# Altium project Servo-Board-v1.0.PrjPcb (part 6 of 19)

## Sheet Encoder_Sheet1.SchDoc
size 420 x 297 mm; SheetNumber: 13; SheetTotal: 32
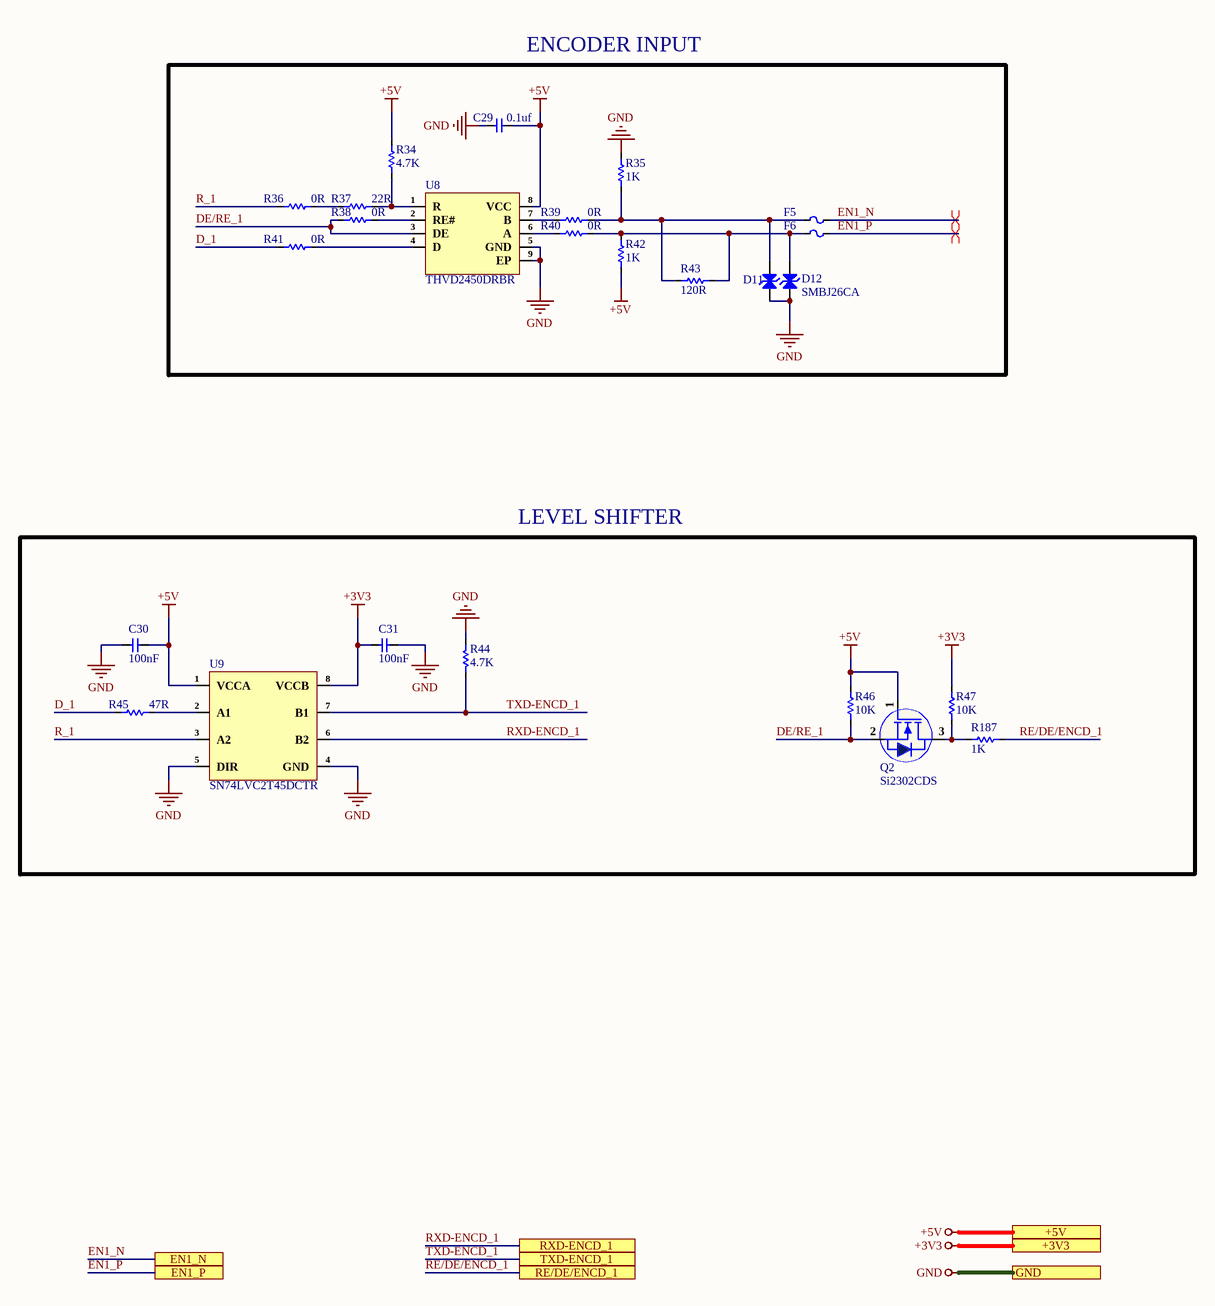
[diagram p12: Encoder_Sheet1.SchDoc]

### Parts
C29  0.1uf  [Cap-0402]
C30  100nF  [cap-0402]
C31  100nF  [cap-0402]
D11  SMBJ26CA  [SMB Bi Directional]  (value not drawn)
D12  SMBJ26CA  [SMB Bi Directional]
F5  SMD0805P020TF  [Fuse-0805]  (value not drawn)
F6  SMD0805P020TF  [Fuse-0805]  (value not drawn)
Q2  Si2302CDS  [Sot-23]
R34  4.7K  [Res-0402]
R35  1K  [Res-0402]
R36  0R  [Res-0603]
R37  22R  [Res-0402]
R38  0R  [Res-0603]
R39  0R  [Res-0603]
R40  0R  [Res-0603]
R41  0R  [Res-0603]
R42  1K  [Res-0402]
R43  120R  [Res-0402]
R44  4.7K  [Res-0402]
R45  47R  [Res-0402]
R46  10K  [Res-0402]
R47  10K  [Res-0402]
R187  1K  [Res-0603]
U8  THVD2450DRBR  [SON-8-EP(3x3)]
U9  SN74LVC2T45DCTR  [MSOP-8]

### Ports
+3V3 (see Servo1[3C], CAN_Sheet[5D], Connector_Sheet[5D], Controller_Sheet[5D], Encoder_Sheet2[5D], Encoder_Sheet3[5D], Encoder_Sheet4[5D], EtherCAT_Sheet[5D], Motor_Driver_Sheet1[5D], Motor_Driver_Sheet2[5D], Motor_Driver_Sheet3[5D], Motor_Driver_Sheet4[5D], Power_Sheet[5D], RJ45_Sheet[5D], RS485_RS232_Sheet[3D], Sec_Controller_Sheet1[5D], Sec_Controller_Sheet2[5D], Sec_Controller_Sheet3[5D], Sec_Controller_Sheet4[5D]), +5V (see Servo1[3C], CAN_Sheet[5D], DIO_1[5D], DIO_2[5D], DIO_3[5D], DIO_4[5D], Encoder_Sheet2[5D], Encoder_Sheet3[5D], Encoder_Sheet4[5D], Power_Sheet[5D]), EN1_N (see Servo1[3D], Connector_Sheet[3D], Servo1[3D]), EN1_P (see Servo1[3C], Connector_Sheet[3D], Servo1[3C]), GND (see Servo1[3C], CAN_Sheet[5D], Connector_Sheet[5D], Controller_Sheet[5D], DIO_1[5D], DIO_2[5D], DIO_3[5D], DIO_4[5D], Encoder_Sheet2[5D], Encoder_Sheet3[5D], Encoder_Sheet4[5D], EtherCAT_Sheet[5D], MOSFET_Driver_Sheet1[5D], MOSFET_Driver_Sheet2[5D], MOSFET_Driver_Sheet3[5D], MOSFET_Driver_Sheet4[5D], Motor_Driver_Sheet1[5D], Motor_Driver_Sheet2[5D], Motor_Driver_Sheet3[5D], Motor_Driver_Sheet4[5D], Power_Sheet[5D], RJ45_Sheet[5D], RS485_RS232_Sheet[3D], Sec_Controller_Sheet1[5D], Sec_Controller_Sheet2[5D], Sec_Controller_Sheet3[5D], Sec_Controller_Sheet4[5D]), RE/DE/ENCD_1 (see Servo1[3C], Sec_Controller_Sheet1[1D]), RXD-ENCD_1 (see Servo1[3C], Sec_Controller_Sheet1[1D]), TXD-ENCD_1 (see Servo1[3C], Sec_Controller_Sheet1[1D])

### Nets
+3V3: C31.1 R47.1 U9.8(VCCB) ; port +3V3
+5V: C29.2 C30.1 Q2.1(G) R34.2 R42.1 R46.1 U8.8(VCC) U9.1(VCCA) ; port +5V
GND: C29.1 C30.2 C31.2 D11.1(A) D12.1(A) R35.2 R44.2 U8.5(GND) U8.9(EP) U9.4(GND) U9.5(DIR) ; port GND
D_1: R41.1 R45.1
DE/RE_1: Q2.2(S) R38.1 R46.2 U8.3(DE)
EN1_N: F5.2 ; port EN1_N
EN1_P: F6.2 ; port EN1_P
R_1: R36.1 U9.3(A2)
RE/DE/ENCD_1: R187.2 ; port RE/DE/ENCD_1
RXD-ENCD_1: U9.6(B2) ; port RXD-ENCD_1
TXD-ENCD_1: R44.1 U9.7(B1) ; port TXD-ENCD_1
NetD11_2: D11.2(K) F5.1 R35.1 R39.2 R43.1
NetD12_2: D12.2(K) F6.1 R40.2 R42.2 R43.2
NetQ2_3: Q2.3(D) R47.2 R187.1
NetR34_1: R34.1 R37.2 U8.1(R)
NetR36_2: R36.2 R37.1
NetR38_2: R38.2 U8.2(RE#)
NetR39_1: R39.1 U8.7(B)
NetR40_1: R40.1 U8.6(A)
NetR41_2: R41.2 U8.4(D)
NetR45_2: R45.2 U9.2(A1)

### Layout directives
differential pair; net class RS485; differential pair class RS485_LINES; rule Impedance Constraint [Min = 115.0    Max = 120.0    ]; rule Matched Net Lengths [Tolerance = 0.508mm]: EN1_N, EN1_P

### Notes on the sheet
- ENCODER INPUT
- LEVEL SHIFTER
- File:
- Title:
- Date:
- Page
- Num:
- Total:
- Drawn By: Huzaifa Ali

### Library data of the parts
C29 = GRM155R62A104KE14D: CAP CER 0.1UF 100V X5R 0402; Manufacturer: Murata; Capacitance: 100nF; Tolerance: 10%; Item Type: Capacitor; Supplier 1: Arrow Electronics; Manufacturer Part Number: GRM155R62A104KE14D; RoHS: Yes; Category: Ceramic Capacitors; Stock 1: 870000; Pricing 1: 10000=0.00500, 20000=0.00410, 30000=0.00390, 50000=0.00370, 100000=0.00300 (USD); Mount: Surface Mount; Case/Package: 0402; Case Code (Metric): 1005; Case Code (Imperial): 0402; Weight: 0.000212oz; Min Operating Temperature: -55°C; Max Operating Temperature: 85°C; Packaging: Tape and Reel; Voltage Rating: 100V; Dielectric: X5R; Termination: SMD/SMT; Voltage Rating (DC): 100V; Package Quantity: 10000; Series: GRM; Length: 0.039inch; Width: 0.02inch; Height: 0.5mm; Thickness: 0.022inch; Reach SVHC Compliant: Yes; Lead Free: Lead Free; RoHS Compliant: Yes; ComponentLink1URL: http://www.farnell.com/datasheets/2079151.pdf?src-supplier=Farnell; ComponentLink1Description: http://www.farnell.com/datasheets/2079151.pdf?src-supplier=Farnell; ComponentLink2URL: http://www.mouser.com/ds/2/281/c02e-2905.pdf?src-supplier=Mouser; ComponentLink2Description: http://www.mouser.com/ds/2/281/c02e-2905.pdf?src-supplier=Mouser; ComponentLink3URL: http://www.farnell.com/datasheets/2079151.pdf?src-supplier=Element14; ComponentLink3Description: http://www.farnell.com/datasheets/2079151.pdf?src-supplier=Element14; ComponentLink4URL: http://search.murata.co.jp/Ceramy/image/img/A01X/G101/ENG/GRM155R62A104KE14-01.pdf?src-supplier=Digi-Key; ComponentLink4Description: http://search.murata.co.jp/Ceramy/image/img/A01X/G101/ENG/GRM155R62A104KE14-01.pdf?src-supplier=Digi-Key; ComponentLink5URL: http://www.farnell.com/datasheets/2079151.pdf?src-supplier=Newark; ComponentLink5Description: http://www.farnell.com/datasheets/2079151.pdf?src-supplier=Newark; Supplier Part Number 1: GRM155R62A104KE14D; LCSC Part Number: C162178
C30 C31 = C1005X7R1H104KT000F: as C8 on sheet Sec_Controller_Sheet1; Supplier 1: Avnet; Manufacturer Part Number: C1005X7R1H104KT000F; RoHS: No; Category: Ceramic Capacitors; Dielectric: X7R; Supplier Part Number 1: C1005X7R1H104KT000F; LCSC Part Number: C361198; ComponentLink1Description: LCSC; ComponentLink1URL: https://www.lcsc.com/product-detail/Multilayer-Ceramic-Capacitors-MLCC-SMD-SMT_TDK-C1005X7R1H104KT000F_C361198.html
D11 D12 = SMBJ26CA: SMB(DO-214AA) TVS ROHS; Manufacturer: MSKSEMI; Item Type: Diode; Manufacturer Part Number: SMBJ26CA; Package: SMB(DO-214AA); LCSC Part Number: C5331111; ComponentLink1Description: LCSC; ComponentLink1URL: https://www.lcsc.com/product-detail/TVS_MSKSEMI-SMBJ26CA_C5331111.html
F5 F6 = SMD0805P020TF: 9V 200mA 100A 500mA 0805 Resettable Fuses ROHS; Manufacturer: RUILON; Item Type: Fuse; Manufacturer Part Number: SMD0805P020TF; Package: 0805; LCSC Part Number: C20976; ComponentLink1Description: LCSC; ComponentLink1URL: https://www.lcsc.com/product-detail/Resettable-Fuses_RUILON-Shenzhen-Ruilongyuan-Elec-SMD0805P020TF_C20976.html
Q2 = Si2302CDS: N-CHANNEL 20-V (D-S) MOSFET; Manufacturer: TECH PUBLIC; ComponentLink1Description: LCSC; ComponentLink1URL: https://www.lcsc.com/product-detail/MOSFETs_TECH-PUBLIC-SI2302CDS_C5310968.html; Manufacturer Part Number: SI2302CDS; Package: SOT-23; LCSC Part Number: C5310968; Item Type: Mosfet
R34 R44 = RC0402FR-074K7L: RES 4.7K OHM 1% 1/16W 0402; Manufacturer: Yageo; Voltage Rating (DC): 50V; Power Rating: 62.5mW; Resistance: 4.7kR; Temperature Coefficient: 100ppm/°C; Max Power Dissipation: 63mW; Item Type: Resistor; Supplier 1: Avnet; Manufacturer Part Number: RC0402FR-074K7L; RoHS: Yes; Category: Chip SMD Resistors; Stock 1: 2420000; Pricing 1: 10000=0.00085 (USD); Case/Package: 0402; Number of Pins: 2; Case Code (Imperial): 0402; Case Code (Metric): 1005; Size Code: 0402; Min Operating Temperature: -55°C; Max Operating Temperature: 155°C; Tolerance: 1%; Voltage Rating: 50V; Packaging: Tape and Reel; Resistor Type: Thick Film; Termination: SMD/SMT; Features: Moisture Resistant; Series: RC; Number of Terminations: 2; Resistance Tolerance: 1%; Construction: Rectangular; Length: 1mm; Width: 0.5mm; Height: 0.32mm; Depth: 0.5mm; Height - Seated (Max): 0.016inch; RoHS Compliant: Yes; Reach SVHC Compliant: Yes; Military Standard: Not; Lead Free: Lead Free; ComponentLink1URL: https://datasheet.ciiva.com/22661/1686128-22661342.pdf?src-supplier=Element14; ComponentLink1Description: https://datasheet.ciiva.com/22661/1686128-22661342.pdf?src-supplier=Element14; ComponentLink2URL: https://datasheet.ciiva.com/7850/1018594-7850022.pdf?src-supplier=Element14; ComponentLink2Description: https://datasheet.ciiva.com/7850/1018594-7850022.pdf?src-supplier=Element14; ComponentLink3URL: https://datasheet.ciiva.com/7850/1018594-7850023.pdf?src-supplier=Element14; ComponentLink3Description: https://datasheet.ciiva.com/7850/1018594-7850023.pdf?src-supplier=Element14; ComponentLink4URL: https://datasheet.ciiva.com/15215/getdatasheetpartid-328119-15215035.pdf?src-supplier=Verical; ComponentLink4Description: https://datasheet.ciiva.com/15215/getdatasheetpartid-328119-15215035.pdf?src-supplier=Verical; Supplier Part Number 1: RC0402FR-074K7L; LCSC Part Number: C105871
R35 R42 = RC0402FR-071KL: as R84 on sheet MOSFET_Driver_Sheet1; Supplier 1: Avnet; Manufacturer Part Number: RC0402FR-071KL; RoHS: Yes; Category: Chip SMD Resistors; Stock 1: 13030000; Pricing 1: 10000=0.00085, 20000=0.00087, 40000=0.00084, 60000=0.00083, 80000=0.00079, 100000=0.00078, 1000000=0.00076 (USD); Case/Package: 0402; Number of Pins: 2; Case Code (Imperial): 0402; Case Code (Metric): 1005; Size Code: 0402; Min Operating Temperature: -55°C; Max Operating Temperature: 155°C; Resistor Type: Thick Film; Tolerance: 1%; Packaging: Tape and Reel; Voltage Rating: 50V; Termination: SMD/SMT; Features: Moisture Resistant; Series: RC; Number of Terminations: 2; Resistance Tolerance: 1%; Construction: Rectangular; Technology: THICK FILM; Length: 1mm; Width: 0.5mm; Height: 0.32mm; Depth: 0.5mm; Reach SVHC Compliant: Yes; Lead Free: Lead Free; RoHS Compliant: Yes; Military Standard: Not; ComponentLink1URL: https://datasheet.ciiva.com/11819/0900766b80c66297-11819477.pdf?src-supplier=RSComponents; ComponentLink1Description: https://datasheet.ciiva.com/11819/0900766b80c66297-11819477.pdf?src-supplier=RSComponents; ComponentLink2URL: https://datasheet.ciiva.com/7983/1018594-7983502.pdf?src-supplier=Element14; ComponentLink2Description: https://datasheet.ciiva.com/7983/1018594-7983502.pdf?src-supplier=Element14; ComponentLink3URL: https://datasheet.ciiva.com/22747/1018594-22747513.pdf?src-supplier=Element14; ComponentLink3Description: https://datasheet.ciiva.com/22747/1018594-22747513.pdf?src-supplier=Element14; ComponentLink4URL: https://datasheet.ciiva.com/12666/pyu-rc0402-51-rohs-l-6-r-12666741.pdf?src-supplier=Mouser; ComponentLink4Description: https://datasheet.ciiva.com/12666/pyu-rc0402-51-rohs-l-6-r-12666741.pdf?src-supplier=Mouser; ComponentLink5URL: https://datasheet.ciiva.com/7849/1018594-7849869.pdf?src-supplier=Element14; ComponentLink5Description: https://datasheet.ciiva.com/7849/1018594-7849869.pdf?src-supplier=Element14; ComponentLink6URL: https://datasheet.ciiva.com/7849/1018594-7849871.pdf?src-supplier=Element14; ComponentLink6Description: https://datasheet.ciiva.com/7849/1018594-7849871.pdf?src-supplier=Element14; ComponentLink7URL: https://datasheet.ciiva.com/17063/pyu-rc0402-51-rohs-l-6-r-17063193.pdf?src-supplier=Future+Electronics; ComponentLink7Description: https://datasheet.ciiva.com/17063/pyu-rc0402-51-rohs-l-6-r-17063193.pdf?src-supplier=Future+Electronics; Supplier Part Number 1: RC0402FR-071KL; LCSC Part Number: C106235
R36 R38-R41 = RC0603JR-070RL: as R49-R51 on sheet Sec_Controller_Sheet1; Supplier 1: Digi-Key; Manufacturer Part Number: RC0603JR-070RL; RoHS: Yes; Category: Chip SMD Resistors; Stock 1: 18081776; Pricing 1: 1=0.10000, 10=0.01700, 25=0.01240, 50=0.00960, 100=0.00700, 250=0.00536, 500=0.00430, 1000=0.00316 (USD); Case/Package: 0603; Number of Pins: 2; Contact Plating: Tin,Matte; Case Code (Imperial): 0603; Case Code (Metric): 1608; Size Code: 0603; Min Operating Temperature: -55°C; Max Operating Temperature: 155°C; Resistor Type: Thick Film; Packaging: Tape and Reel; Termination: SMD/SMT; Series: RC; Technology: THICK FILM; Package Quantity: 5000; Voltage Rating: 50V; Features: Moisture Resistant; Max Power Dissipation: 100mW; Number of Terminations: 2; Construction: Rectangular; Length: 1.6mm; Width: 0.8mm; Height: 0.45mm; Depth: 0.8mm; Radiation Hardening: No; Reach SVHC Compliant: No SVHC; Lead Free: Lead Free; RoHS Compliant: Yes; Military Standard: Not; Supplier Part Number 1: 311-0.0GRCT-ND; LCSC Part Number: C95177
R37 = RC0402FR-0722RL: RES 22 OHM 1% 1/16W 0402; Manufacturer: Yageo; Voltage Rating: 50V; Power Rating: 62.5mW; Temperature Coefficient: 100ppm/°C; Max Power Dissipation: 63mW; Item Type: Resistor; Supplier 1: Avnet; Manufacturer Part Number: RC0402FR-0722RL; RoHS: Yes; Category: Chip SMD Resistors; Stock 1: 1810000; Pricing 1: 10000=0.00085 (USD); Case/Package: 0402; Number of Pins: 2; Case Code (Imperial): 0402; Case Code (Metric): 1005; Size Code: 0402; Min Operating Temperature: -55°C; Max Operating Temperature: 155°C; Resistor Type: Thick Film; Voltage Rating (DC): 50V; Resistance: 22R; Tolerance: 1%; Packaging: Tape and Reel; Termination: SMD/SMT; Features: Moisture Resistant; Series: RC; Number of Terminations: 2; Resistance Tolerance: 1%; Technology: THICK FILM; Construction: Rectangular; Length: 1mm; Width: 0.5mm; Height: 0.32mm; Depth: 0.5mm; RoHS Compliant: Yes; Reach SVHC Compliant: Yes; Military Standard: Not; Lead Free: Lead Free; ComponentLink1URL: https://datasheet.ciiva.com/11819/0900766b80c66297-11819462.pdf?src-supplier=RSComponents; ComponentLink1Description: https://datasheet.ciiva.com/11819/0900766b80c66297-11819462.pdf?src-supplier=RSComponents; ComponentLink2URL: https://datasheet.ciiva.com/7849/1018594-7849912.pdf?src-supplier=Element14; ComponentLink2Description: https://datasheet.ciiva.com/7849/1018594-7849912.pdf?src-supplier=Element14; ComponentLink3URL: https://datasheet.ciiva.com/7849/1018594-7849911.pdf?src-supplier=Element14; ComponentLink3Description: https://datasheet.ciiva.com/7849/1018594-7849911.pdf?src-supplier=Element14; ComponentLink4URL: https://datasheet.ciiva.com/16930/pyu-rc0402-51-rohs-l-6-r-16930687.pdf?src-supplier=Future+Electronics; ComponentLink4Description: https://datasheet.ciiva.com/16930/pyu-rc0402-51-rohs-l-6-r-16930687.pdf?src-supplier=Future+Electronics; ComponentLink5URL: https://datasheet.ciiva.com/26829/getdatasheetpartid-554995-26829991.pdf?src-supplier=Verical; ComponentLink5Description: https://datasheet.ciiva.com/26829/getdatasheetpartid-554995-26829991.pdf?src-supplier=Verical; Supplier Part Number 1: RC0402FR-0722RL; LCSC Part Number: C114765
R43 = RC0402FR-07120RL: RES 120 OHM 1% 1/16W 0402; Manufacturer: Yageo; Item Type: Resistors; Power Rating: 62.5mW; Voltage Rating: 50V; Temperature Coefficient: 100ppm/°C; Max Power Dissipation: 63mW; Supplier: Future Electronics; Supplier Part Number: 4529079; Manufacturer Part Number: RC0402FR-07120RL; RoHS: Yes; Stock: 150000; Pricing: 10000=0.0012, 100000=0.0011, 300000=0.001, 750000=0.001, 2000000=0.0009 (USD); Case/Package: 0402; Case Code (Imperial): 0402; Case Code (Metric): 1005; Min Operating Temperature: -55°C; Max Operating Temperature: 155°C; Package Quantity: 1; Value: 120R; Tolerance: 1%; Packaging: Tape and Reel; Termination: SMD/SMT; Resistor Type: Thick Film; Number of Terminations: 2; Features: Moisture Resistant; Series: RC; Resistance Tolerance: 1%; Construction: Rectangular; Technology: THICK FILM; Voltage Rating (AC): 50V; Length: 0.039inch; Width: 0.02inch; Height: 0.016inch; Depth: 0.5mm; Reach SVHC Compliant: No; Military Standard: Not; RoHS Compliant: Yes; Lead Free: 5697LeadFree; ComponentLink1URL: https://datasheet.ciiva.com/12667/pyu-rc0402-51-rohs-l-6-r-12667958.pdf?src-supplier=Mouser; ComponentLink1Description: https://datasheet.ciiva.com/12667/pyu-rc0402-51-rohs-l-6-r-12667958.pdf?src-supplier=Mouser; ComponentLink2URL: https://datasheet.ciiva.com/7849/1018594-7849831.pdf?src-supplier=Element14; ComponentLink2Description: https://datasheet.ciiva.com/7849/1018594-7849831.pdf?src-supplier=Element14; LCSC Part Number: C114758
R45 = RC0402FR-0747RL: RES 47 OHM 1% 1/16W 0402; Manufacturer: Yageo; Temperature Coefficient: 100ppm/°C; Power Rating: 63mW; Voltage Rating: 50V; Item Type: Resistor; Supplier 1: Avnet; Manufacturer Part Number: RC0402FR-0747RL; RoHS: Yes; Category: Chip SMD Resistors; Stock 1: 390000; Pricing 1: 10000=0.00085 (USD); Case/Package: 0402; Case Code (Metric): 1005; Case Code (Imperial): 0402; Weight: 2.3E-05oz; Size Code: 0402; Min Operating Temperature: -55°C; Max Operating Temperature: 155°C; Resistance: 47R; Tolerance: 1%; Packaging: Tape and Reel; Resistor Type: Thick Film; Package Quantity: 1; Number of Terminations: 2; Termination: SMD/SMT; Max Power Dissipation: 63mW; Features: Moisture Resistant; Series: RC; Construction: Rectangular; Technology: THICK FILM; Resistance Tolerance: 1%; Length: 1mm; Width: 0.02inch; Height: 0.016inch; Depth: 0.5mm; Lead Free: Lead Free; Military Standard: Not; RoHS Compliant: Yes; Supplier Part Number 1: RC0402FR-0747RL; LCSC Part Number: C137973; ComponentLink1Description: LCSC; ComponentLink1URL: https://www.lcsc.com/product-detail/Chip-span-style-background-color-ff0-Resistor-span-Surface-Mount_YAGEO-RC0402FR-0747RL_C137973.html
R46 R47 = RC0402FR-0710KL: as R9 on sheet Sec_Controller_Sheet1; Supplier 1: Mouser; Manufacturer Part Number: RC0402FR-0710KL; RoHS: Yes; Category: Chip SMD Resistors; Stock 1: 18648329; Pricing 1: 1=0.10000, 10=0.01400, 50=0.01400, 100=0.00500, 1000=0.00300, 10000=0.00200 (USD); Case/Package: 0402; Number of Pins: 2; Case Code (Imperial): 0402; Case Code (Metric): 1005; Min Operating Temperature: -55°C; Max Operating Temperature: 155°C; Resistor Type: Thick Film; Tolerance: 1%; Packaging: Tape and Reel; Voltage Rating: 50V; Termination: SMD/SMT; Working Voltage: 50V; Number of Terminations: 2; Features: Moisture Resistant; Series: RC; Resistance Tolerance: 1%; Construction: Rectangular; Length: 1mm; Width: 0.5mm; Height: 0.32mm; Depth: 0.5mm; Lead Pitch: 0.2mm; REACH SVHC: No SVHC; Lead Free: Lead Free; RoHS Compliant: Yes; Military Standard: Not; ComponentLink1URL: https://datasheet.ciiva.com/7660/38568-7660787.pdf?src-supplier=Element14; ComponentLink1Description: https://datasheet.ciiva.com/7660/38568-7660787.pdf?src-supplier=Element14; ComponentLink2URL: https://datasheet.ciiva.com/7849/1686128-7849814.pdf?src-supplier=Element14; ComponentLink2Description: https://datasheet.ciiva.com/7849/1686128-7849814.pdf?src-supplier=Element14; ComponentLink3URL: https://datasheet.ciiva.com/7983/1018594-7983486.pdf?src-supplier=Element14; ComponentLink3Description: https://datasheet.ciiva.com/7983/1018594-7983486.pdf?src-supplier=Element14; ComponentLink4URL: https://datasheet.ciiva.com/22747/1018594-22747512.pdf?src-supplier=Element14; ComponentLink4Description: https://datasheet.ciiva.com/22747/1018594-22747512.pdf?src-supplier=Element14; ComponentLink5URL: https://datasheet.ciiva.com/12667/pyu-rc0402-51-rohs-l-6-r-12667067.pdf?src-supplier=Mouser; ComponentLink5Description: https://datasheet.ciiva.com/12667/pyu-rc0402-51-rohs-l-6-r-12667067.pdf?src-supplier=Mouser; ComponentLink6URL: https://datasheet.ciiva.com/7849/1784430-7849813.pdf?src-supplier=Element14; ComponentLink6Description: https://datasheet.ciiva.com/7849/1784430-7849813.pdf?src-supplier=Element14; ComponentLink7URL: https://datasheet.ciiva.com/7849/1784430-7849815.pdf?src-supplier=Element14; ComponentLink7Description: https://datasheet.ciiva.com/7849/1784430-7849815.pdf?src-supplier=Element14; Supplier Part Number 1: 603-RC0402FR-0710KL; LCSC Part Number: C60490
R187 = RC0603FR-071KL: RES SMD 1K OHM 1% 1/10W 0603; Manufacturer: Yageo; Resistance: 1kR; Temperature Coefficient: 100ppm/°C; Power Rating: 100mW; Voltage Rating: 50V; Item type: Resistor; ComponentLink1URL: https://www.verical.com/server-webapp/html/getDatasheet?partID=409289&src-supplier=Verical; ComponentLink1Description: https://www.verical.com/server-webapp/html/getDatasheet?partID=409289&src-supplier=Verical; Supplier 1: Digi-Key; Manufacturer Part Number: RC0603FR-071KL; Stock 1: 21472395; Pricing 1: 1=0.1, 10=0.023, 100=0.0094, 1000=0.0042, 2500=0.0037 (USD); Case/Package: 0603; Contact Plating: Tin,Matte; Case Code (Imperial): 0603; Case Code (Metric): 1608; Min Operating Temperature: -55°C; Max Operating Temperature: 155°C; Tolerance: 1%; Composition: Thick Film; Packaging: Tape and Reel; Termination: SMD/SMT; Military Standard: Not; Length: 1.6mm; Height: 0.45mm; Depth: 0.8mm; Radiation Hardening: No; REACH SVHC: No SVHC; Lead Free: Lead Free; ComponentLink2URL: http://documents.rs-components.com/techlib://itc_doclist_GB.htm?stockno=5048928&src-supplier=RSComponents; ComponentLink2Description: http://documents.rs-components.com/techlib://itc_doclist_GB.htm?stockno=5048928&src-supplier=RSComponents; ComponentLink3URL: http://www.yageo.com/documents/recent/PYu-RC0603_51_RoHS_L_4.pdf?src-supplier=Avnet+Europe; ComponentLink3Description: http://www.yageo.com/documents/recent/PYu-RC0603_51_RoHS_L_4.pdf?src-supplier=Avnet+Europe; ComponentLink4URL: http://www.farnell.com/datasheets/2167052.pdf?src-supplier=Element14; ComponentLink4Description: http://www.farnell.com/datasheets/2167052.pdf?src-supplier=Element14; ComponentLink5URL: http://www.farnell.com/datasheets/1868787.pdf?src-supplier=Element14; ComponentLink5Description: http://www.farnell.com/datasheets/1868787.pdf?src-supplier=Element14; ComponentLink6URL: http://www.yageo.com/documents/recent/PYu-RC_Group_51_RoHS_L_2.pdf?src-supplier=Avnet; ComponentLink6Description: http://www.yageo.com/documents/recent/PYu-RC_Group_51_RoHS_L_2.pdf?src-supplier=Avnet; ComponentLink7URL: https://www.verical.com/server-webapp/html/getDatasheet?partID=404327&src-supplier=Verical; ComponentLink7Description: https://www.verical.com/server-webapp/html/getDatasheet?partID=404327&src-supplier=Verical; ComponentLink8URL: http://www.farnell.com/datasheets/443971.pdf?src-supplier=Element14; ComponentLink8Description: http://www.farnell.com/datasheets/443971.pdf?src-supplier=Element14; Supplier Part Number 1: 311-1.00KHRDKR-ND; LCSC Part Number: C22548
U8 = THVD2450DRBR: IC TRANSCEIVER HALF 1/1 8SON; Manufacturer: Texas Instruments; Supplier: Digikey; Supplier Part Number: 296-THVD2450DRBRCT-ND; Manufacturer Part Number: THVD2450DRBR; RoHS: Yes; Item Type: IC; Stock: 2652; Pricing: 1=4.05, 10=3.639, 25=3.4404, 100=2.9818, 250=2.82892, 500=2.53838, 1000=2.1408 (USD); Pins: 8NUMBER; Length: 3mm; Width: 3mm; Height: 1mm; Thickness: 880um; LCSC Part Number: C2878080
U9 = SN74LVC2T45DCTR: IC TRANSLATOR BIDIRECTIONAL SM8; Manufacturer: Texas Instruments; Supplier: Mouser; LCSC Part Number: C22672; Manufacturer Part Number: SN74LVC2T45DCTR; RoHS: Yes; Item Type: IC; Stock: 182025; Pricing: 1=0.83, 10=0.709, 50=0.709, 100=0.567, 1000=0.413, 10000=0.334 (USD); ComponentLink1URL: https://datasheet.ciiva.com/15086/getdatasheetpartid-190128-15086325.pdf?src-supplier=Verical; ComponentLink1Description: https://datasheet.ciiva.com/15086/getdatasheetpartid-190128-15086325.pdf?src-supplier=Verical; ComponentLink2URL: https://datasheet.ciiva.com/1899/sn74lvc2t45-1899281.pdf?src-supplier=Digikey; ComponentLink2Description: https://datasheet.ciiva.com/1899/sn74lvc2t45-1899281.pdf?src-supplier=Digikey; ComponentLink3URL: https://datasheet.ciiva.com/34301/1046748-34301921.pdf?src-supplier=Jameco; ComponentLink3Description: https://datasheet.ciiva.com/34301/1046748-34301921.pdf?src-supplier=Jameco; ComponentLink4URL: https://datasheet.ciiva.com/1628/1862500-1628670.pdf?src-supplier=Newark; ComponentLink4Description: https://datasheet.ciiva.com/1628/1862500-1628670.pdf?src-supplier=Newark; ComponentLink5URL: https://datasheet.ciiva.com/46395/1882347-46395882.pdf?src-supplier=Element14; ComponentLink5Description: https://datasheet.ciiva.com/46395/1882347-46395882.pdf?src-supplier=Element14; ComponentLink6URL: https://datasheet.ciiva.com/22653/sn74lvc2t45-22653414.pdf?src-supplier=Farnell; ComponentLink6Description: https://datasheet.ciiva.com/22653/sn74lvc2t45-22653414.pdf?src-supplier=Farnell; ComponentLink7URL: https://datasheet.ciiva.com/14300/sn74lvc2t45-14300710.pdf?src-supplier=Avnet; ComponentLink7Description: https://datasheet.ciiva.com/14300/sn74lvc2t45-14300710.pdf?src-supplier=Avnet; ComponentLink8URL: https://datasheet.ciiva.com/14300/sn74lvc2t45-14300711.pdf?src-supplier=Avnet; ComponentLink8Description: https://datasheet.ciiva.com/14300/sn74lvc2t45-14300711.pdf?src-supplier=Avnet; ComponentLink9URL: https://datasheet.ciiva.com/1899/sn74lvc2t45-1899282.pdf?src-supplier=Digikey; ComponentLink9Description: https://datasheet.ciiva.com/1899/sn74lvc2t45-1899282.pdf?src-supplier=Digikey; ComponentLink10URL: https://datasheet.ciiva.com/1899/sn74lvc2t45-1899283.pdf?src-supplier=Digikey; ComponentLink10Description: https://datasheet.ciiva.com/1899/sn74lvc2t45-1899283.pdf?src-supplier=Digikey; ComponentLink11URL: https://datasheet.ciiva.com/1508/1863620-1508814.pdf?src-supplier=Element14; ComponentLink11Description: https://datasheet.ciiva.com/1508/1863620-1508814.pdf?src-supplier=Element14

## Sheet DIO_1.SchDoc
size 420 x 297 mm; SheetNumber: 14; SheetTotal: 32
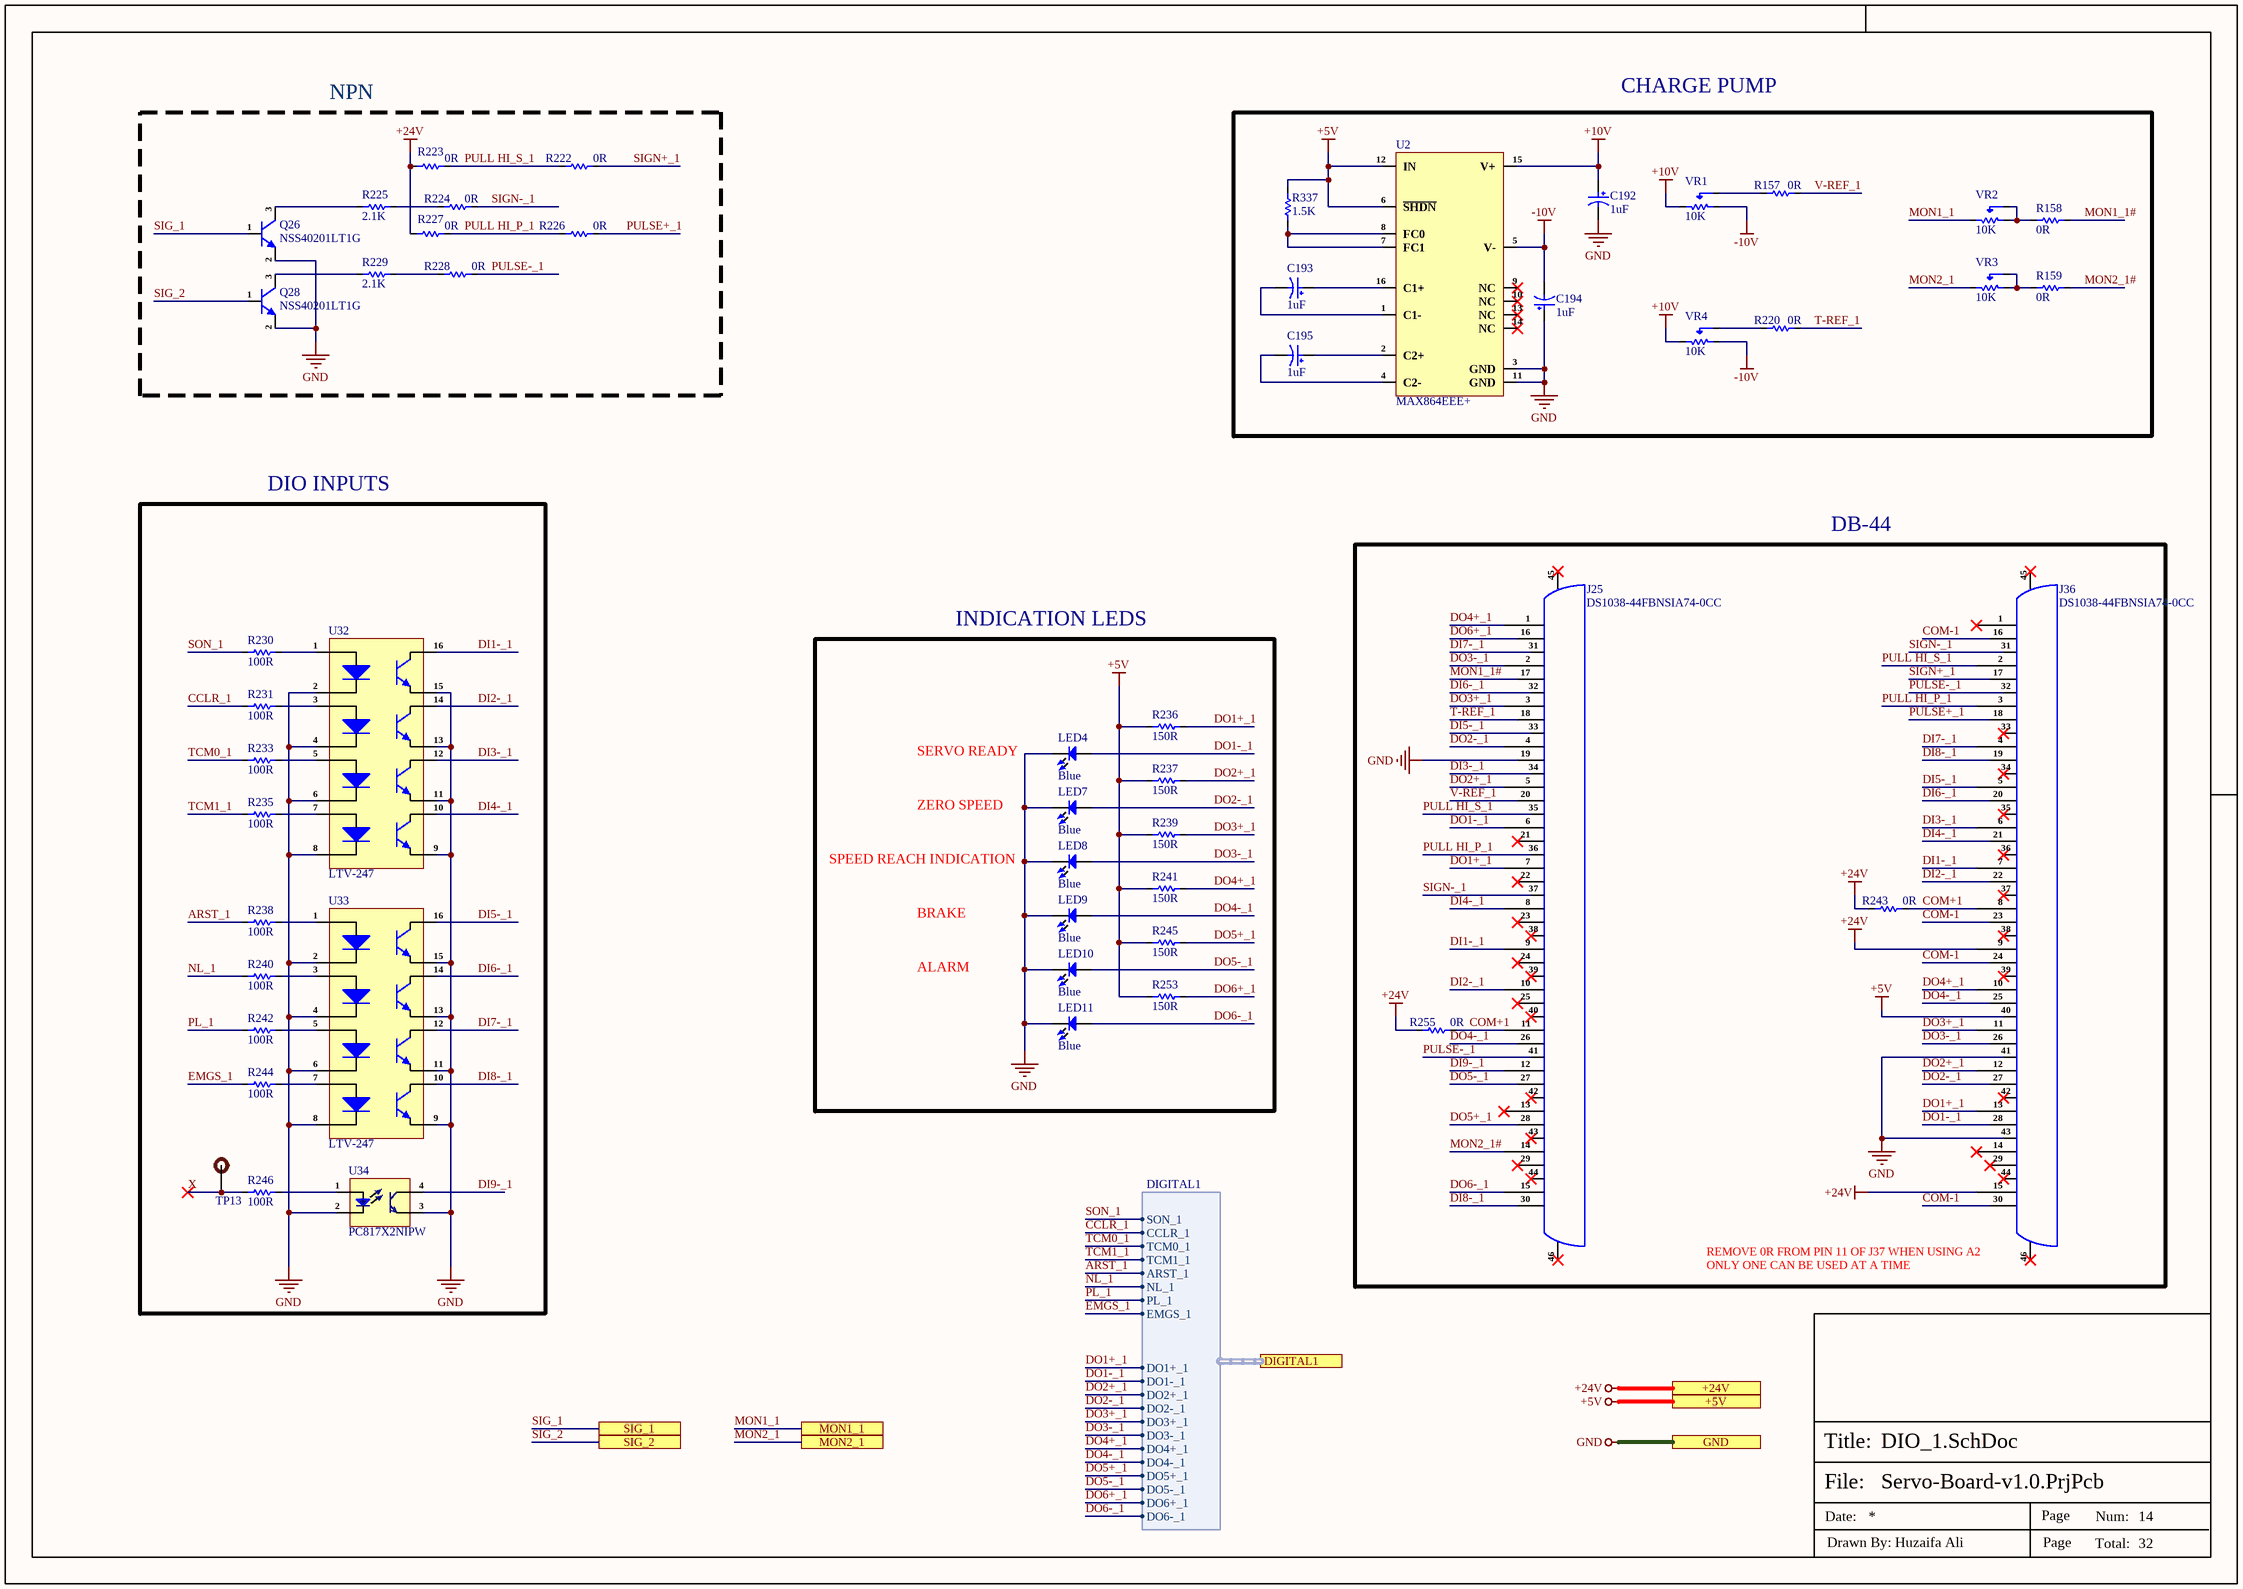
[diagram p13: DIO_1.SchDoc]

### Parts
C192  1uF  [RVT1H1R0M0405]
C193  1uF  [RVT1H1R0M0405]
C194  1uF  [RVT1H1R0M0405]
C195  1uF  [RVT1H1R0M0405]
J25  DS1038-44FBNSIA74-0CC  [DS1038-44FBNSIA74-0CC]
J36  DS1038-44FBNSIA74-0CC  [DS1038-44FBNSIA74-0CC]
LED4  Blue  [LED-0603]
LED7  Blue  [LED-0603]
LED8  Blue  [LED-0603]
LED9  Blue  [LED-0603]
LED10  Blue  [LED-0603]
LED11  Blue  [LED-0603]
Q26  NSS40201LT1G  [SOT-23]
Q28  NSS40201LT1G  [SOT-23]
R157  0R  [Res-0402]
R158  0R  [Res-0402]
R159  0R  [Res-0402]
R220  0R  [Res-0402]
R222  0R  [Res-0603]
R223  0R  [Res-0603]
R224  0R  [Res-0603]
R225  2.1K  [Res-0603]
R226  0R  [Res-0603]
R227  0R  [Res-0603]
R228  0R  [Res-0603]
R229  2.1K  [Res-0603]
R230  100R  [Res-0402]
R231  100R  [Res-0402]
R233  100R  [Res-0402]
R235  100R  [Res-0402]
R236  150R  [Res-0603]
R237  150R  [Res-0603]
R238  100R  [Res-0402]
R239  150R  [Res-0603]
R240  100R  [Res-0402]
R241  150R  [Res-0603]
R242  100R  [Res-0402]
R243  0R  [Res-0402]
R244  100R  [Res-0402]
R245  150R  [Res-0603]
R246  100R  [Res-0402]
R253  150R  [Res-0603]
R255  0R  [Res-0603]
R337  1.5K  [Res-0402]
TP13  TEST POINT  [Test-point]  (value not drawn)  (no BOM)
U2  MAX864EEE+  [16-QSOP]
U32  LTV-247  [16-SO]
U33  LTV-247  [16-SO]
U34  PC817X2NIPW  [PC817X2NIPW]
VR1  10K  [3362P-1-103]
VR2  10K  [3362P-1-103]
VR3  10K  [3362P-1-103]
VR4  10K  [3362P-1-103]

### Blocks framed on the sheet
NPN: Q26 Q28 R222-R229

### Ports
+5V (see Servo1[4C], CAN_Sheet[5D], DIO_2[5D], DIO_3[5D], DIO_4[5D], Encoder_Sheet1[5D], Encoder_Sheet2[5D], Encoder_Sheet3[5D], Encoder_Sheet4[5D], Power_Sheet[5D]), +24V (see Servo1[4C], Connector_Sheet[5D], DIO_2[5D], DIO_3[5D], DIO_4[5D], MOSFET_Driver_Sheet1[5D], MOSFET_Driver_Sheet2[5D], MOSFET_Driver_Sheet3[5D], MOSFET_Driver_Sheet4[5D], Motor_Driver_Sheet1[5D], Motor_Driver_Sheet2[5D], Motor_Driver_Sheet3[5D], Motor_Driver_Sheet4[5D], Power_Sheet[5D]), DIGITAL1 (harness DIGITAL1, see Servo1[4C], Sec_Controller_Sheet1[4D]), GND (see Servo1[4C], CAN_Sheet[5D], Connector_Sheet[5D], Controller_Sheet[5D], DIO_2[5D], DIO_3[5D], DIO_4[5D], Encoder_Sheet1[5D], Encoder_Sheet2[5D], Encoder_Sheet3[5D], Encoder_Sheet4[5D], EtherCAT_Sheet[5D], MOSFET_Driver_Sheet1[5D], MOSFET_Driver_Sheet2[5D], MOSFET_Driver_Sheet3[5D], MOSFET_Driver_Sheet4[5D], Motor_Driver_Sheet1[5D], Motor_Driver_Sheet2[5D], Motor_Driver_Sheet3[5D], Motor_Driver_Sheet4[5D], Power_Sheet[5D], RJ45_Sheet[5D], RS485_RS232_Sheet[3D], Sec_Controller_Sheet1[5D], Sec_Controller_Sheet2[5D], Sec_Controller_Sheet3[5D], Sec_Controller_Sheet4[5D]), MON1_1 (see Servo1[4C], Sec_Controller_Sheet1[3D]), MON2_1 (see Servo1[4C], Sec_Controller_Sheet1[3D]), SIG_1 (see Servo1[4C], Sec_Controller_Sheet1[3D]), SIG_2 (see Servo1[4C], Sec_Controller_Sheet1[3D])

### Harnesses
DIGITAL1: SON_1, TCM0_1, CCLR_1, TCM1_1, ARST_1, NL_1, PL_1, EMGS_1, DO1+_1, DO1-_1, DO2+_1, DO2-_1, DO3+_1, DO3-_1, DO4+_1, DO4-_1, DO5+_1, DO5-_1, DO6+_1, DO6-_1

### Nets
+5V: J36.40 R236.1 R237.1 R239.1 R241.1 R245.1 R253.1 R337.2 U2.6(~{SHDN}) U2.12(IN) ; port +5V
+10V: C192.1 U2.15(V+) VR1.3(CW) VR4.3(CW)
+24V: J36.9 J36.15 R223.1 R227.1 R243.1 R255.1 ; port +24V  [project net VDRAIN]
-10V: C194.2 U2.5(V-) VR1.1(CCW) VR4.1(CCW)
GND: C192.2 C194.1 J25.19 J36.41 J36.43 LED4.2 LED7.2 LED8.2 LED9.2 LED10.2 LED11.2 Q26.2(E) Q28.2(E) U2.3(GND) U2.11(GND) U32.2(K) U32.4(K) U32.6(K) U32.8(K) U32.9(E) U32.11(E) U32.13(E) U32.15(E) U33.2(K) U33.4(K) U33.6(K) U33.8(K) U33.9(E) U33.11(E) U33.13(E) U33.15(E) U34.2(Ca) U34.3(E) ; port GND
ARST_1: R238.1 ; port DIGITAL1.ARST_1
CCLR_1: R231.1 ; port DIGITAL1.CCLR_1
COM+1: J25.11 J36.8 R243.2 R255.2
COM-1: J36.16 J36.23 J36.24 J36.30
DI1-_1: J25.9 J36.7 U32.16(C)
DI2-_1: J25.10 J36.22 U32.14(C)
DI3-_1: J25.34 J36.6 U32.12(C)
DI4-_1: J25.8 J36.21 U32.10(C)
DI5-_1: J25.33 J36.5 U33.16(C)
DI6-_1: J25.32 J36.20 U33.14(C)
DI7-_1: J25.31 J36.4 U33.12(C)
DI8-_1: J25.30 J36.19 U33.10(C)
DI9-_1: J25.12 U34.4(C)
DO1+_1: J25.7 J36.13 R236.2 ; port DIGITAL1.DO1+_1
DO1-_1: J25.6 J36.28 LED4.1 ; port DIGITAL1.DO1-_1
DO2+_1: J25.5 J36.12 R237.2 ; port DIGITAL1.DO2+_1
DO2-_1: J25.4 J36.27 LED7.1 ; port DIGITAL1.DO2-_1
DO3+_1: J25.3 J36.11 R239.2 ; port DIGITAL1.DO3+_1
DO3-_1: J25.2 J36.26 LED8.1 ; port DIGITAL1.DO3-_1
DO4+_1: J25.1 J36.10 R241.2 ; port DIGITAL1.DO4+_1
DO4-_1: J25.26 J36.25 LED9.1 ; port DIGITAL1.DO4-_1
DO5+_1: J25.28 R245.2 ; port DIGITAL1.DO5+_1
DO5-_1: J25.27 LED10.1 ; port DIGITAL1.DO5-_1
DO6+_1: J25.16 R253.2 ; port DIGITAL1.DO6+_1
DO6-_1: J25.15 LED11.1 ; port DIGITAL1.DO6-_1
EMGS_1: R244.1 ; port DIGITAL1.EMGS_1
MON1_1: VR2.3(CW) ; port MON1_1
MON1_1#: J25.17 R158.2
MON2_1: VR3.3(CW) ; port MON2_1
MON2_1#: J25.14 R159.2
NL_1: R240.1 ; port DIGITAL1.NL_1
PL_1: R242.1 ; port DIGITAL1.PL_1
PULL HI_P_1: J25.36 J36.3 R226.1 R227.2
PULL HI_S_1: J25.35 J36.2 R222.1 R223.2
PULSE+_1: J36.18 R226.2
PULSE-_1: J25.41 J36.32 R228.2
SIG_1: Q26.1(B) ; port SIG_1
SIG_2: Q28.1(B) ; port SIG_2
SIGN+_1: J36.17 R222.2
SIGN-_1: J25.37 J36.31 R224.2
SON_1: R230.1 ; port DIGITAL1.SON_1
T-REF_1: J25.18 R220.2
TCM0_1: R233.1 ; port DIGITAL1.TCM0_1
TCM1_1: R235.1 ; port DIGITAL1.TCM1_1
V-REF_1: J25.20 R157.2
X: R246.1 TP13.1
NetC193_1: C193.1 U2.16(C1+)
NetC193_2: C193.2 U2.1(C1-)
NetC195_1: C195.1 U2.2(C2+)
NetC195_2: C195.2 U2.4(C2-)
NetQ26_3: Q26.3(C) R225.1
NetQ28_3: Q28.3(C) R229.1
NetR157_1: R157.1 VR1.2(Wiper)
NetR158_1: R158.1 VR2.1(CCW) VR2.2(Wiper)
NetR159_1: R159.1 VR3.1(CCW) VR3.2(Wiper)
NetR220_1: R220.1 VR4.2(Wiper)
NetR224_1: R224.1 R225.2
NetR228_1: R228.1 R229.2
NetR230_2: R230.2 U32.1(A)
NetR231_2: R231.2 U32.3(A)
NetR233_2: R233.2 U32.5(A)
NetR235_2: R235.2 U32.7(A)
NetR238_2: R238.2 U33.1(A)
NetR240_2: R240.2 U33.3(A)
NetR242_2: R242.2 U33.5(A)
NetR244_2: R244.2 U33.7(A)
NetR246_2: R246.2 U34.1(An)
NetR337_1: R337.1 U2.7(FC1) U2.8(FC0)

Not connected (* = marked no-connect by the designer): J25 13* 21* 22* 23* 24* 25* 29* 38* 39* 40* 42* 43* 44* 45* 46*; J36 1* 14* 29* 33* 34* 35* 36* 37* 38* 39* 42* 44* 45* 46*; U2 9(NC)* 10(NC)* 13(NC)* 14(NC)*

### Notes on the sheet
- CHARGE PUMP
- DIO INPUTS
- DB-44
- INDICATION LEDS
- SERVO READY
- SPEED REACH INDICATION
- ZERO SPEED
- BRAKE
- ALARM
- REMOVE 0R FROM PIN 11 OF J37 WHEN USING A2
- ONLY ONE CAN BE USED AT A TIME
- File:
- Title:
- Date:
- Page
- Num:
- Total:
- Drawn By: Huzaifa Ali

### Library data of the parts
C192-C195 = RVT1H1R0M0405: 1uF 50V 8mA@120Hz ±20% SMD,D4xL5.4mm Aluminum Electrolytic Capacitors - SMD ROHS; Manufacturer: Roqang; Supplier: LCSC; LCSC Part Number: C72491; Manufacturer Part Number: RVT1H1R0M0405; RoHS: No
J25 J36 = DS1038-44FBNSIA74-0CC: 44P Female D-Sub Right-Angle 3 1.5A -40℃~+105℃ Push-Pull D-Sub / VGA connector ROHS; Manufacturer: CONNFLY Elec; Manufacturer Part Number: DS1038-44FBNSIA74-0CC; Package: Push-Pull; LCSC Part Number: C77844; Item Type: D-Sub / VGA connector; ComponentLink1Description: LCSC; ComponentLink1URL: https://www.lcsc.com/product-detail/D-Sub-VGA-connector_CONNFLY-Elec-DS1038-44FBNSIA74-0CC_C77844.html
LED4 LED7-LED11 = NCD0603B3: blue 0603 Light Emitting Diodes (LED) ROHS; Manufacturer: Foshan NationStar Optoelectronics; Manufacturer Part Number: NCD0603B3; Package: 0603; LCSC Part Number: C158101; Item Type: LED; ComponentLink1Description: LCSC; ComponentLink1URL: https://www.lcsc.com/product-detail/Light-Emitting-Diodes-LED_Foshan-NationStar-Optoelectronics-NCD0603B3_C158101.html
Q26 Q28 = NSS40201LT1G: TRANS NPN 40V 2A SOT23-3; Manufacturer: ON Semiconductor; Max Power Dissipation: 540mW; Transition Frequency: 150MHz; hFE Min: 200; Number of Elements: 1; Emitter Base Voltage (VEBO): 6V; Collector Emitter Saturation Voltage: 115mV; Element Configuration: Single; Clock Frequency: 100MHz; Item Type: Transistor; Supplier 1: Future Electronics; Manufacturer Part Number: NSS40201LT1G; RoHS: Yes; Category: BJTs; Stock 1: 155; Pricing 1: 1=0.42000, 15=0.34000, 75=0.29500, 300=0.25500, 1500=0.21000 (USD); Case/Package: SOT-23-3; Pins: 3; Min Operating Temperature: -55°C; Max Operating Temperature: 150°C; Collector Emitter Voltage (VCEO): 40V; Packaging: Tape and Reel; Max Collector Current: 2A; Collector Emitter Breakdown Voltage: 40V; Polarity: NPN; Package Quantity: 3000; Frequency: 150MHz; Max Breakdown Voltage: 40V; Collector Base Voltage (VCBO): 40V; Power Dissipation: 540mW; Gain Bandwidth Product: 150MHz; Series: -; Collector-emitter Voltage-Max: 115mV; Length: 3.04mm; Width: 2.64mm; Height: 1.11mm; Radiation Hardening: No; Lead Free: Lead Free; Reach SVHC Compliant: Yes; Halogen Free: Halogen Free; RoHS Compliant: Yes; ComponentLink1URL: https://datasheet.ciiva.com/976/nss40201l-d-976800.pdf?src-supplier=Digi-Key; ComponentLink1Description: https://datasheet.ciiva.com/976/nss40201l-d-976800.pdf?src-supplier=Digi-Key; ComponentLink2URL: https://datasheet.ciiva.com/11204/nss40201l-d-11204882.pdf?src-supplier=Avnet; ComponentLink2Description: https://datasheet.ciiva.com/11204/nss40201l-d-11204882.pdf?src-supplier=Avnet; ComponentLink3URL: https://datasheet.ciiva.com/16291/nss40201l-d-115376-16291797.pdf?src-supplier=Mouser; ComponentLink3Description: https://datasheet.ciiva.com/16291/nss40201l-d-115376-16291797.pdf?src-supplier=Mouser; ComponentLink4URL: https://datasheet.ciiva.com/30480/0900766b8121b5a5-30480502.pdf?src-supplier=Rs; ComponentLink4Description: https://datasheet.ciiva.com/30480/0900766b8121b5a5-30480502.pdf?src-supplier=Rs; ComponentLink5URL: https://datasheet.ciiva.com/976/nss40201l-d-976801.pdf?src-supplier=Digi-Key; ComponentLink5Description: https://datasheet.ciiva.com/976/nss40201l-d-976801.pdf?src-supplier=Digi-Key; ComponentLink6URL: https://datasheet.ciiva.com/976/nss40201l-d-976802.pdf?src-supplier=Digi-Key; ComponentLink6Description: https://datasheet.ciiva.com/976/nss40201l-d-976802.pdf?src-supplier=Digi-Key; ComponentLink7URL: https://datasheet.ciiva.com/22641/nss40201l-d-22641179.pdf?src-supplier=Farnell; ComponentLink7Description: https://datasheet.ciiva.com/22641/nss40201l-d-22641179.pdf?src-supplier=Farnell; ComponentLink8URL: https://datasheet.ciiva.com/16222/nss40201l-d-16222093.pdf?src-supplier=Future+Electronics; ComponentLink8Description: https://datasheet.ciiva.com/16222/nss40201l-d-16222093.pdf?src-supplier=Future+Electronics; Supplier Part Number 1: 6030674; LCSC Part Number: C145175
R157-R159 R220 R243 = RC0402FR-070RL: as R48 on sheet Sec_Controller_Sheet1; Supplier 1: Mouser; Manufacturer Part Number: RC0402FR-070RL; RoHS: Yes; Stock 1: 8556842; Pricing 1: 1=0.10000, 10=0.01400, 50=0.01400, 100=0.00600, 1000=0.00300, 5000=0.00200, 10000=0.00100 (USD); Mount: Surface Mount; Case/Package: 0402; Contact Plating: Tin,Matte; Case Code (Imperial): 0402; Case Code (Metric): 1005; Size Code: 0402; Min Operating Temperature: -55°C; Max Operating Temperature: 155°C; Resistance: 0R; Resistor Type: Thick Film; Packaging: Tape and Reel; Termination: SMD/SMT; Features: Moisture Resistant; Series: RC; Number of Terminations: 2; Length: 1mm; Width: 0.5mm; Height: 0.35mm; Radiation Hardening: No; Lead Free: Lead Free; RoHS Compliant: Yes; ComponentLink1URL: https://datasheet.ciiva.com/8896/pyu-rc0402-51-rohs-l-6-8896149.pdf?src-supplier=Avnet; ComponentLink1Description: https://datasheet.ciiva.com/8896/pyu-rc0402-51-rohs-l-6-8896149.pdf?src-supplier=Avnet; ComponentLink2URL: https://datasheet.ciiva.com/16790/pyu-rc0402-51-rohs-l-6-r-16790444.pdf?src-supplier=Future+Electronics; ComponentLink2Description: https://datasheet.ciiva.com/16790/pyu-rc0402-51-rohs-l-6-r-16790444.pdf?src-supplier=Future+Electronics; Supplier Part Number 1: 603-RC0402FR-070RL; LCSC Part Number: C106231
R222-R224 R226-R228 R255 = RC0603JR-070RL: as R49-R51 on sheet Sec_Controller_Sheet1; Supplier 1: Digi-Key; Manufacturer Part Number: RC0603JR-070RL; RoHS: Yes; Category: Chip SMD Resistors; Stock 1: 18081776; Pricing 1: 1=0.10000, 10=0.01700, 25=0.01240, 50=0.00960, 100=0.00700, 250=0.00536, 500=0.00430, 1000=0.00316 (USD); Case/Package: 0603; Number of Pins: 2; Contact Plating: Tin,Matte; Case Code (Imperial): 0603; Case Code (Metric): 1608; Size Code: 0603; Min Operating Temperature: -55°C; Max Operating Temperature: 155°C; Resistor Type: Thick Film; Packaging: Tape and Reel; Termination: SMD/SMT; Series: RC; Technology: THICK FILM; Package Quantity: 5000; Voltage Rating: 50V; Features: Moisture Resistant; Max Power Dissipation: 100mW; Number of Terminations: 2; Construction: Rectangular; Length: 1.6mm; Width: 0.8mm; Height: 0.45mm; Depth: 0.8mm; Radiation Hardening: No; Reach SVHC Compliant: No SVHC; Lead Free: Lead Free; RoHS Compliant: Yes; Military Standard: Not; Supplier Part Number 1: 311-0.0GRCT-ND; LCSC Part Number: C95177
R225 R229 = RT0603BRD072K1L: RES SMD 2.1K OHM 0.1% 1/10W 0603; Manufacturer: Yageo; Resistance: 2.1kR; Voltage Rating: 75V; Power Rating: 100mW; Temperature Coefficient: 25ppm/°C; Voltage Rating (DC): 50V; Item Type: Resistor; Supplier 1: Arrow Electronics; Manufacturer Part Number: RT0603BRD072K1L; RoHS: Yes; Category: Chip SMD Resistors; Stock 1: 4891; Pricing 1: 1=0.32000, 10=0.26320, 25=0.26040, 100=0.10310, 250=0.10280, 500=0.10180, 1000=0.06110, 3000=0.03900 (USD); Case/Package: 0603; Case Code (Imperial): 0603; Case Code (Metric): 1608; Min Operating Temperature: -55°C; Max Operating Temperature: 125°C; Tolerance: 0.1%; Packaging: Tape and Reel; Resistor Type: Thin Film; Number of Terminations: 2; Termination: SMD/SMT; Max Power Dissipation: 100mW; Features: Moisture Resistant; Series: RT; Construction: Rectangular; Length: 0.063inch; Width: 0.031inch; Height: 0.022inch; Depth: 0.8mm; Military Standard: Not; Lead Free: Lead Free; RoHS Compliant: Yes; ComponentLink1URL: https://datasheet.ciiva.com/12723/pyu-rt-1-to-0-05-rohs-l-4-12723880.pdf?src-supplier=Mouser; ComponentLink1Description: https://datasheet.ciiva.com/12723/pyu-rt-1-to-0-05-rohs-l-4-12723880.pdf?src-supplier=Mouser; Supplier Part Number 1: RT0603BRD072K1L; LCSC Part Number: C861293
R230 R231 R233 R235 R238 R240 R242 R244 R246 = RC0402FR-07100RL: RES 100 OHM 1% 1/16W 0402; Manufacturer: Yageo; Power Rating: 62.5mW; Voltage Rating: 50V; Temperature Coefficient: 100ppm/°C; Max Power Dissipation: 63mW; Item Type: Resistor; Supplier 1: Mouser; Manufacturer Part Number: RC0402FR-07100RL; RoHS: Yes; Category: Chip SMD Resistors; Stock 1: 699545; Pricing 1: 1=0.10000, 10=0.01200, 50=0.01200, 100=0.00500, 1000=0.00300, 2500=0.00200, 10000=0.00100 (USD); Case/Package: 0402; Number of Pins: 2; Case Code (Imperial): 0402; Case Code (Metric): 1005; Size Code: 0402; Min Operating Temperature: -55°C; Max Operating Temperature: 155°C; Tolerance: 1%; Voltage Rating (DC): 50V; Resistance: 100R; Packaging: Tape and Reel; Termination: SMD/SMT; Resistor Type: Thick Film; Features: Moisture Resistant; Series: RC; Number of Terminations: 2; Resistance Tolerance: 1%; Construction: Rectangular; Technology: THICK FILM; Length: 1mm; Width: 0.5mm; Height: 0.32mm; Depth: 0.5mm; RoHS Compliant: Yes; REACH SVHC: No SVHC; Military Standard: Not; Lead Free: Lead Free; ComponentLink1URL: https://datasheet.ciiva.com/11808/0900766b80c66297-11808765.pdf?src-supplier=RSComponents; ComponentLink1Description: https://datasheet.ciiva.com/11808/0900766b80c66297-11808765.pdf?src-supplier=RSComponents; ComponentLink2URL: https://datasheet.ciiva.com/7849/1784430-7849810.pdf?src-supplier=Element14; ComponentLink2Description: https://datasheet.ciiva.com/7849/1784430-7849810.pdf?src-supplier=Element14; ComponentLink3URL: https://datasheet.ciiva.com/28367/1018594-28367226.pdf?src-supplier=Element14; ComponentLink3Description: https://datasheet.ciiva.com/28367/1018594-28367226.pdf?src-supplier=Element14; ComponentLink4URL: https://datasheet.ciiva.com/22747/1018594-22747511.pdf?src-supplier=Element14; ComponentLink4Description: https://datasheet.ciiva.com/22747/1018594-22747511.pdf?src-supplier=Element14; ComponentLink5URL: https://datasheet.ciiva.com/12667/pyu-rc0402-51-rohs-l-6-r-12667957.pdf?src-supplier=Mouser; ComponentLink5Description: https://datasheet.ciiva.com/12667/pyu-rc0402-51-rohs-l-6-r-12667957.pdf?src-supplier=Mouser; ComponentLink6URL: https://datasheet.ciiva.com/15189/getdatasheetpartid-329466-15189335.pdf?src-supplier=Verical; ComponentLink6Description: https://datasheet.ciiva.com/15189/getdatasheetpartid-329466-15189335.pdf?src-supplier=Verical; ComponentLink7URL: https://datasheet.ciiva.com/16740/pyu-rc0402-51-rohs-l-6-r-16740566.pdf?src-supplier=Future+Electronics; ComponentLink7Description: https://datasheet.ciiva.com/16740/pyu-rc0402-51-rohs-l-6-r-16740566.pdf?src-supplier=Future+Electronics; Supplier Part Number 1: 603-RC0402FR-07100RL; LCSC Part Number: C106232
R236 R237 R239 R241 R245 R253 = RC0603DR-07150RL: RES 150 OHM 0.5% 1/10W 0603; Manufacturer: Yageo; Max Power Dissipation: 100mW; Temperature Coefficient: 100ppm/°C; Item Type: Resistor; Supplier 1: Avnet; Manufacturer Part Number: RC0603DR-07150RL; RoHS: Yes; Category: Chip SMD Resistors; Pricing 1: 5000=0.00430, 10000=0.00424, 20000=0.00411 (USD); Case/Package: 0603; Min Operating Temperature: -55°C; Max Operating Temperature: 155°C; Packaging: Tape and Reel; Resistance: 150R; Resistor Type: Thick Film; Number of Terminations: 2; Tolerance: 0.5%; Features: Moisture Resistant; Length: 0.063inch; Width: 0.031inch; Height: 0.022inch; RoHS Compliant: Yes; ComponentLink1URL: http://www.yageo.com.tw/exep/pages/download/literatures/PYu-R_INT-thick_7.pdf?src-supplier=Digi-Key; ComponentLink1Description: http://www.yageo.com.tw/exep/pages/download/literatures/PYu-R_INT-thick_7.pdf?src-supplier=Digi-Key; Supplier Part Number 1: RC0603DR-07150RL; LCSC Part Number: C471801
R337 = RC0402FR-071K5L: RES 1.5K OHM 1% 1/16W 0402; Manufacturer: Yageo; Resistance: 1.5kR; Power Rating: 62.5mW; Voltage Rating: 50V; Temperature Coefficient: 100ppm/°C; Max Power Dissipation: 63mW; Supplier 1: Digi-Key; Manufacturer Part Number: RC0402FR-071K5L; RoHS: Yes; Category: Chip SMD Resistors; Stock 1: 2832947; Pricing 1: 1=0.10000, 10=0.01500, 100=0.00610, 1000=0.00275, 2500=0.00239, 5000=0.00197 (USD); Case/Package: 0402; Case Code (Metric): 1005; Case Code (Imperial): 0402; Size Code: 0402; Min Operating Temperature: -55°C; Max Operating Temperature: 155°C; Resistor Type: Thick Film; Package Quantity: 1; Tolerance: 1%; Packaging: Tape and Reel; Number of Terminations: 2; Termination: SMD/SMT; Features: Moisture Resistant; Series: RC; Resistance Tolerance: 1%; Construction: Rectangular; Technology: THICK FILM; Length: 1mm; Width: 0.02inch; Height: 0.016inch; Depth: 0.5mm; RoHS Compliant: Yes; REACH SVHC: No SVHC; Military Standard: Not; Lead Free: Lead Free; ComponentLink1URL: https://datasheet.ciiva.com/11808/0900766b80c66297-11808238.pdf?src-supplier=RSComponents; ComponentLink1Description: https://datasheet.ciiva.com/11808/0900766b80c66297-11808238.pdf?src-supplier=RSComponents; ComponentLink2URL: https://datasheet.ciiva.com/46394/1018594-46394950.pdf?src-supplier=Element14; ComponentLink2Description: https://datasheet.ciiva.com/46394/1018594-46394950.pdf?src-supplier=Element14; ComponentLink3URL: https://datasheet.ciiva.com/2453/pyu-r-int-thick-7-2453440.pdf?src-supplier=Digi-Key; ComponentLink3Description: https://datasheet.ciiva.com/2453/pyu-r-int-thick-7-2453440.pdf?src-supplier=Digi-Key; ComponentLink4URL: https://datasheet.ciiva.com/2453/pyu-r-int-thick-7-2453441.pdf?src-supplier=Digi-Key; ComponentLink4Description: https://datasheet.ciiva.com/2453/pyu-r-int-thick-7-2453441.pdf?src-supplier=Digi-Key; ComponentLink5URL: https://datasheet.ciiva.com/2453/pyu-r-int-thick-7-2453439.pdf?src-supplier=Digi-Key; ComponentLink5Description: https://datasheet.ciiva.com/2453/pyu-r-int-thick-7-2453439.pdf?src-supplier=Digi-Key; ComponentLink6URL: https://datasheet.ciiva.com/12558/pyu-rc0402-51-rohs-l-6-r-8721-12558542.pdf?src-supplier=Mouser; ComponentLink6Description: https://datasheet.ciiva.com/12558/pyu-rc0402-51-rohs-l-6-r-8721-12558542.pdf?src-supplier=Mouser; ComponentLink7URL: https://datasheet.ciiva.com/7849/1018594-7849863.pdf?src-supplier=Element14; ComponentLink7Description: https://datasheet.ciiva.com/7849/1018594-7849863.pdf?src-supplier=Element14; ComponentLink8URL: https://datasheet.ciiva.com/7849/1018594-7849864.pdf?src-supplier=Element14; ComponentLink8Description: https://datasheet.ciiva.com/7849/1018594-7849864.pdf?src-supplier=Element14; ComponentLink9URL: https://datasheet.ciiva.com/15189/getdatasheetpartid-323992-15189370.pdf?src-supplier=Verical; ComponentLink9Description: https://datasheet.ciiva.com/15189/getdatasheetpartid-323992-15189370.pdf?src-supplier=Verical; Supplier Part Number 1: 311-1.50KLRCT-ND; LCSC Part Number: C114759
TP13 = TEST POINT: Test Point ON; Item Type: TEST POINT
U2 = MAX864EEE+: IC REG CHARGE PUMP INV 16QSOP; Manufacturer: Maxim; Output Current: 20mA; Output Voltage: 12V; Logic Function: Inverting; Number of Outputs: 2; Switching Frequency: 185kHz; Synchronous Rectifier: No; Topology: Boost; Output Type: Adjustable; Max Supply Voltage: 6V; Min Supply Voltage: 1.75V; Operating Supply Current: 7mA; Min Output Voltage: 3.5V; Supplier: Digikey; Supplier Part Number: MAX864EEE+-ND; Manufacturer Part Number: MAX864EEE+; RoHS: Yes; Item Type: IC; Stock: 443; Pricing: 1=4.9, 10=4.399, 25=4.1588, 100=3.6042, 300=3.41937, 500=3.06818, 1000=2.58762, 2500=2.45824 (USD); Mounting Technology: Surface Mount; Case/Package: QSOP; Pins: 16; Weight: 0.010159oz; Min Operating Temperature: -40°C; Max Operating Temperature: 85°C; Packaging: Rail/Tube; Package Quantity: 100; Series: -; Min Input Voltage: 1.75V; Max Output Voltage: 12V; Termination: SMD/SMT; Length: 4.98mm; Width: 3.99mm; Height: 1.55mm; Radiation Hardening: No; Lead Free: Lead Free; RoHS Compliant: Yes; Reach SVHC Compliant: No; ComponentLink1URL: https://datasheet.ciiva.com/3215/max864-3215728.pdf?src-supplier=Avnet; ComponentLink1Description: https://datasheet.ciiva.com/3215/max864-3215728.pdf?src-supplier=Avnet; ComponentLink2URL: https://datasheet.ciiva.com/3216/max864-3216791.pdf?src-supplier=Avnet; ComponentLink2Description: https://datasheet.ciiva.com/3216/max864-3216791.pdf?src-supplier=Avnet; ComponentLink3URL: https://datasheet.ciiva.com/4874/max864-4874972.pdf?src-supplier=Mouser; ComponentLink3Description: https://datasheet.ciiva.com/4874/max864-4874972.pdf?src-supplier=Mouser; ComponentLink4URL: https://datasheet.ciiva.com/7994/9917-7994860.pdf?src-supplier=Element14; ComponentLink4Description: https://datasheet.ciiva.com/7994/9917-7994860.pdf?src-supplier=Element14
U32 U33 = LTV-247: OPTOISO 3.75KV 4CH TRANS 16SO; Manufacturer: Vishay Lite-On; Number of Channels: 4; Collector Emitter Voltage (VCEO): 80V; Reverse Breakdown Voltage: 6V; Forward Voltage: 1.2V; Forward Current: 20mA; Max Power Dissipation: 200mW; Output Current per Channel: 50mA; Collector Emitter Saturation Voltage: 400mV; Power Dissipation: 170mW; Current Transfer Ratio: 600%; Item Type: PhotoTransistor; Supplier 1: Future Electronics; Manufacturer Part Number: LTV-247; RoHS: Yes; Category: Optocouplers; Stock 1: 178000; Pricing 1: 2000=0.77000 (USD); Mount: Surface Mount; Case/Package: SMD/SMT; Number of Pins: 16; Min Operating Temperature: -55°C; Max Operating Temperature: 110°C; Package Quantity: 2000; Packaging: Tape and Reel; Max Output Voltage: 80V; Max Collector Current: 50mA; Number of Elements: 4; Max Input Current: 50mA; Radiation Hardening: No; RoHS Compliant: Yes; ComponentLink1URL: https://datasheet.ciiva.com/24015/ltv-247-256860-24015561.pdf?src-supplier=Mouser; ComponentLink1Description: https://datasheet.ciiva.com/24015/ltv-247-256860-24015561.pdf?src-supplier=Mouser; ComponentLink2URL: https://datasheet.ciiva.com/29730/ltv-214-244-29730320.pdf?src-supplier=Digi-Key; ComponentLink2Description: https://datasheet.ciiva.com/29730/ltv-214-244-29730320.pdf?src-supplier=Digi-Key; Supplier Part Number 1: 3051235; LCSC Part Number: C115451; ComponentLink3Description: LCSC; ComponentLink3URL: https://www.lcsc.com/product-detail/Optocouplers-Phototransistor-Output_Lite-On-LTV-247_C115451.html
U34 = PC817X2NIPW: Optoisolator Output Channel 4-SMD; Manufacturer: Sharp; Item Type: IC; Supplier: Mouser; Supplier Part Number: 852-PC817X2NIPW; Manufacturer Part Number: PC817X2NIPW; RoHS: No; Pricing: 1=0.54, 10=0.352, 50=0.352, 100=0.233, 1000=0.185, 10000=0.146 (USD); LCSC Part Number: C2840443
VR1-VR4 = 3362P-1-103: TRIMMER 10K OHM 0.5W PC PIN TOP; Manufacturer: Bourns; Item Type: Potentiometer; Supplier: Mouser; LCSC Part Number: C118956; Manufacturer Part Number: 3362P-1-103; RoHS: No; Stock: 1436; Pricing: 1=1.97, 10=1.44, 50=1.44, 100=1.13, 1000=0.756, 10000=0.756 (USD); ComponentLink1URL: https://datasheet.ciiva.com/19466/1931499-19466806.pdf?src-supplier=Jameco; ComponentLink1Description: https://datasheet.ciiva.com/19466/1931499-19466806.pdf?src-supplier=Jameco; ComponentLink2URL: https://datasheet.ciiva.com/3266/3362-3266710.pdf?src-supplier=Avnet; ComponentLink2Description: https://datasheet.ciiva.com/3266/3362-3266710.pdf?src-supplier=Avnet; ComponentLink3URL: https://datasheet.ciiva.com/2161/3362-2161230.pdf?src-supplier=Digikey; ComponentLink3Description: https://datasheet.ciiva.com/2161/3362-2161230.pdf?src-supplier=Digikey